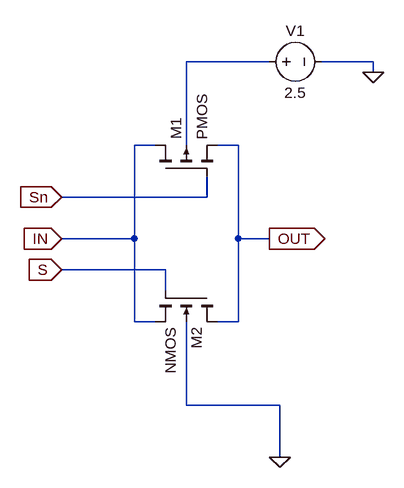
[diagram p0: schematic transmissionGate.asc]
transmissionGate.asc, the LTspice schematic file:
Version 4
SHEET 1 880 680
WIRE 320 -576 192 -576
WIRE 480 -576 400 -576
WIRE 480 -560 480 -576
WIRE 144 -448 112 -448
WIRE 192 -448 192 -576
WIRE 272 -448 240 -448
WIRE 224 -368 224 -400
WIRE 224 -368 0 -368
WIRE 112 -304 112 -448
WIRE 112 -304 0 -304
WIRE 272 -304 272 -448
WIRE 320 -304 272 -304
WIRE 160 -256 0 -256
WIRE 160 -224 160 -256
WIRE 112 -176 112 -304
WIRE 144 -176 112 -176
WIRE 272 -176 272 -304
WIRE 272 -176 240 -176
WIRE 192 -48 192 -176
WIRE 336 -48 192 -48
WIRE 336 32 336 -48
FLAG 0 -304 IN
IOPIN 0 -304 In
FLAG 320 -304 OUT
IOPIN 320 -304 Out
FLAG 0 -256 S
IOPIN 0 -256 In
FLAG 0 -368 Sn
IOPIN 0 -368 In
FLAG 480 -560 0
FLAG 336 32 0
SYMBOL pmos4 144 -400 R270
SYMATTR InstName M1
SYMATTR Value2 l=2.4u w=10.8u
SYMBOL nmos4 240 -224 R90
SYMATTR InstName M2
SYMATTR Value2 l=2.4u w=3.6u
SYMBOL voltage 304 -576 R270
WINDOW 0 32 56 VTop 2
WINDOW 3 -32 56 VBottom 2
WINDOW 123 0 0 Left 2
WINDOW 39 0 0 Left 2
SYMATTR InstName V1
SYMATTR Value 2.5

The netlist it stands for:
* transmissionGate.asc
M1 IN Sn OUT N001 PMOS l=2.4u w=10.8u
M2 OUT S IN 0 NMOS l=2.4u w=3.6u
V1 N001 0 2.5
.model NMOS NMOS
.model PMOS PMOS
.lib standard.mos
.backanno
.end